# EAGLE design comp_pet_revealed_v1.0c (EAGLE 4.16)
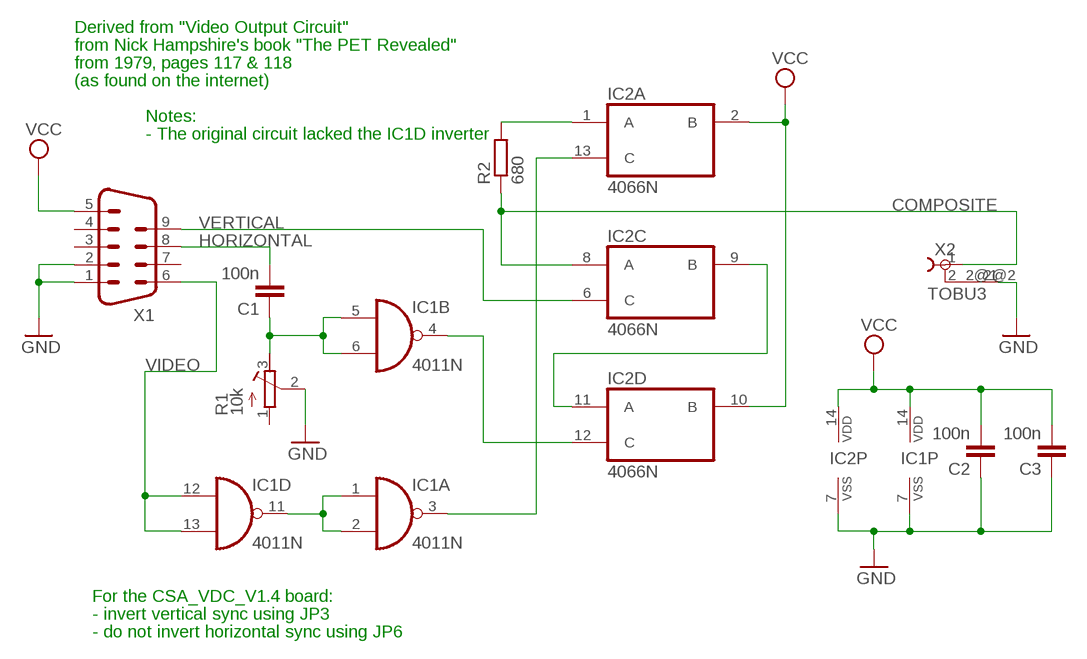
[diagram p0: schematic, sheet 1]

## Parts
C1  100n  C-EU050-025X075  [C050-025X075]
C2  100n  C-EU050-025X075  [C050-025X075]
C3  100n  C-EU050-025X075  [C050-025X075]
IC1  4011N  [DIL14]
IC2  4066N  [DIL14]
R1  10k  R-TRIMM3339P  [RTRIM3339P]
R2  680  R-EU_0207/10  [0207/10]
X1  M09H  [M09H]
X2  TOBU3  [TOBU3]

## Nets
COMPOSITE: IC2.8(C:A) R2.1 X2.1
GND: C2.1 C3.1 IC1.7(P:VSS) IC2.7(P:VSS) R1.2(S) X1.1 X1.2 X2.2@2
HORIZONTAL: C1.2 X1.8
N$1: IC1.1(A:I0) IC1.2(A:I1) IC1.11(D:O)
N$2: C1.1 IC1.5(B:I0) IC1.6(B:I1) R1.3(A)
N$5: IC2.1(A:A) R2.2
N$7: IC1.3(A:O) IC2.13(A:C)
N$8: IC1.4(B:O) IC2.12(D:C)
N$9: IC2.9(C:B) IC2.11(D:A)
VCC: C2.2 C3.2 IC1.14(P:VDD) IC2.2(A:B) IC2.10(D:B) IC2.14(P:VDD) X1.5
VERTICAL: IC2.6(C:C) X1.9
VIDEO: IC1.12(D:I0) IC1.13(D:I1) X1.6
Unconnected: IC1.8(C:I0) IC1.9(C:I1) IC1.10(C:O) IC2.3(B:B) IC2.4(B:A) IC2.5(B:C) R1.1(E) X1.3 X1.4 X1.7 X2.2 X2.2@1

## Notes on the sheet
- Derived from "Video Output Circuit"
- from Nick Hampshire's book "The PET Revealed"
- from 1979, pages 117 & 118
- (as found on the internet)
- Notes:
- - The original circuit lacked the IC1D inverter
- For the CSA_VDC_V1.4 board:
- - invert vertical sync using JP3
- - do not invert horizontal sync using JP6

## Library data of the parts
C1-C3 = rcl:C-EU: CAPACITOR, European symbol
IC1 = 40xx:4011: Quad 2-input NAND
IC2 = 40xx:4066: Quad bilateral ANALOG SWITCH
R1 = rcl:R-TRIMM: Trimm resistor
R2 = rcl:R-EU_: RESISTOR, European symbol
X1 = con-subd:M09: SUB-D
X2 = con-hirschmann:TOBU3: Female Cinch CONNECTOR

## Board
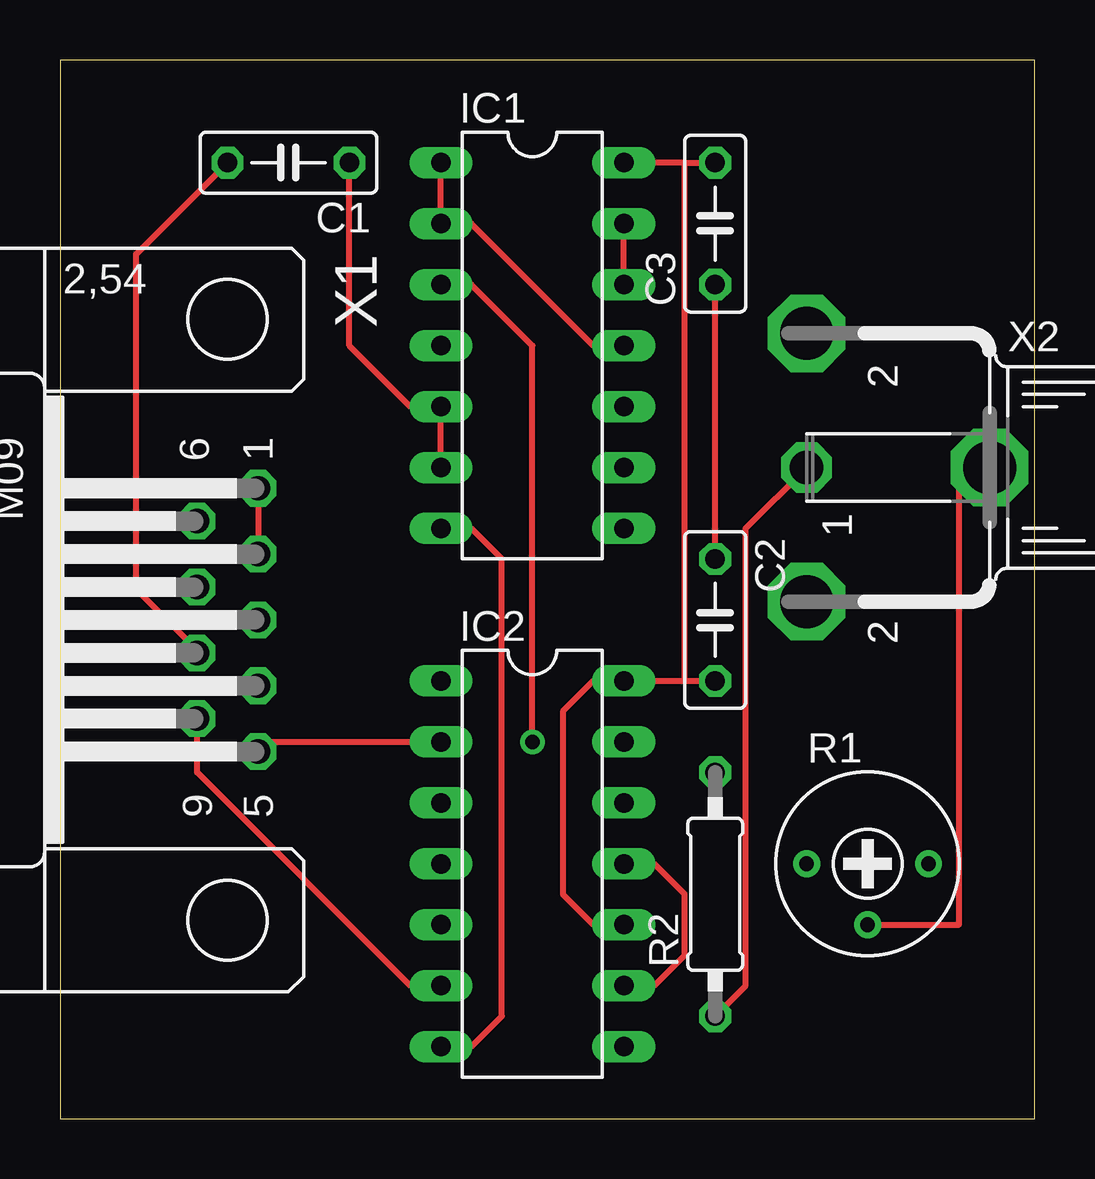
[diagram p1: board, top side]
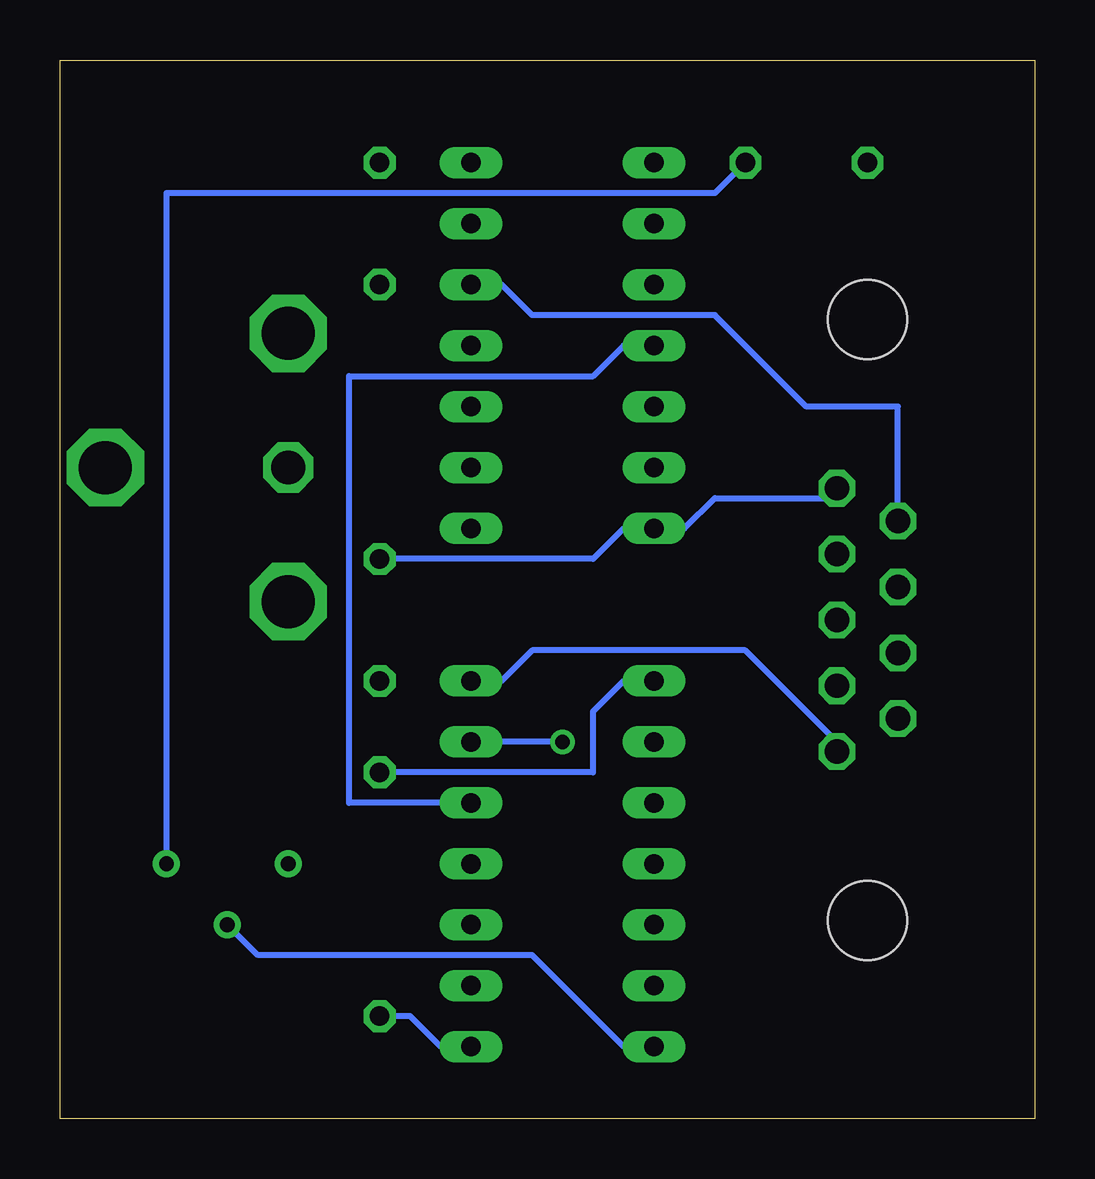
[diagram p2: board, bottom side, seen from below]

Size 40.62 x 44.12 mm. Coordinates in mm from the lower left corner, seen from the top.
Outline: 0,0 40.62,0 40.62,44.12 0,44.12 0,0
Copper layers (1*16): Top 0.035mm / dielectric 1.5mm / Bottom 0.035mm
Design rules "default": minimum track width 10mil, minimum drill 24mil, track to track 8mil, track to pad 8mil, pad to pad 8mil, via to via 8mil, smd to smd 8mil, copper to edge 40mil, drill to drill 8mil, minimum pad ring 10mil, minimum via ring 8mil, stop-mask expansion 4mil, vias tented up to drill 0mil, thermal gap 10mil

### Footprints (pad centres in the part's own frame; a part is rotated, then mirrored left to right if it is on the bottom)
C050-025X075 = drill 0.813 octagon: 1 -2.54,0; 2 2.54,0
DIL14 = drill 0.813 long: 1 -7.62,-3.81; 2 -5.08,-3.81; 3 -2.54,-3.81; 4 0,-3.81; 5 2.54,-3.81; 6 5.08,-3.81; 7 7.62,-3.81; 8 7.62,3.81; 9 5.08,3.81; 10 2.54,3.81; 11 0,3.81; 12 -2.54,3.81; 13 -5.08,3.81; 14 -7.62,3.81
RTRIM3339P = drill 0.61 round: 1 -2.54,0; 2 0,-2.54; 3 2.54,0
0207/10 = drill 0.813 octagon: 1 -5.08,0; 2 5.08,0
M09H = drill 1.016 octagon: 1 -5.486,1.27; 2 -2.743,1.27; 3 0,1.27; 4 2.743,1.27; 5 5.486,1.27; 6 -4.115,-1.27; 7 -1.372,-1.27; 8 1.372,-1.27; 9 4.115,-1.27 | hole 3.302: 12.522,0; -12.522,0
TOBU3 = drill 1.397 octagon: 1 0,-2.54 | drill 2.21 octagon: 2 5.588,-2.54; 2@1 -5.588,-2.54; 2@2 0,5.08

### Placement (x,y rotation side)
C1  9.52,39.84 180 top
C2  27.3,20.79 270 top
C3  27.3,37.3 90 top
IC1  19.68,32.22 270 top
IC2  19.68,10.63 270 top
R1  33.65,10.63 0 top
R2  27.3,9.36 90 top
X1  6.98,20.79 270 top
X2  33.65,27.14 270 top

### Tracks (layer width: path | path; a pad name or v marks a point on that pad's centre or on a via)
COMPOSITE
  Top 0.254: X2.1 28.57,24.6 28.57,5.55 R2.1
  Bottom 0.254: R2.1 26.03,4.28 24.76,3.01 IC2.8
GND
  Top 0.254: 8.25,23.33 X1.2 X1.1 | C2.1 C3.1 | R1.2 37.46,8.09 37.46,27.14 X2.2@2 | IC1.7 17.14,24.6 18.41,23.33 18.41,4.28 17.14,3.01 IC2.7
  Bottom 0.254: X1.1 8.25,25.87 13.33,25.87 14.6,24.6 IC1.7 17.14,24.6 18.41,23.33 C2.1 | R1.2 32.38,6.82 20.95,6.82 17.14,3.01 IC2.7
HORIZONTAL
  Top 0.254: C1.2 3.17,36.03 3.17,22.06 5.71,19.52 X1.8
N$1
  Top 0.254: IC1.1 IC1.2 17.14,37.3 22.22,32.22 IC1.11
N$2
  Top 0.254: IC1.6 IC1.5 14.6,29.68 12.06,32.22 C1.1
  Bottom 0.254: R1.3 36.19,38.57 13.33,38.57 C1.1
N$5
  Bottom 0.254: R2.2 18.41,14.44 18.41,16.98 17.14,18.25 IC2.1
N$7  (via drill 0.61)
  Top 0.254: v19.68,15.71 19.68,32.22 17.14,34.76 IC1.3
  Bottom 0.254: v19.68,15.71 IC2.13
N$8
  Bottom 0.254: IC2.12 28.57,13.17 28.57,30.95 18.41,30.95 17.14,32.22 IC1.4
N$9
  Top 0.254: IC2.9 24.76,5.55 26.03,6.82 26.03,9.36 24.76,10.63 IC2.11
VCC
  Top 0.254: IC2.2 8.25,15.71 X1.5 | 26.03,39.84 C3.2 | 26.03,39.84 IC1.14 | IC2.10 22.22,8.09 20.95,9.36 20.95,16.98 22.22,18.25 IC2.14 26.03,18.25 | 26.03,18.25 C2.2 | 26.03,18.25 26.03,39.84
  Bottom 0.254: X1.5 8.25,15.71 12.06,19.52 20.95,19.52 22.22,18.25 IC2.14
VERTICAL
  Top 0.254: IC2.6 14.6,5.55 5.71,14.44 X1.9 5.71,16.98
VIDEO
  Top 0.254: IC1.12 IC1.13
  Bottom 0.254: 5.71,24.6 X1.6 5.71,29.68 9.52,29.68 13.33,33.49 20.95,33.49 22.22,34.76 IC1.12